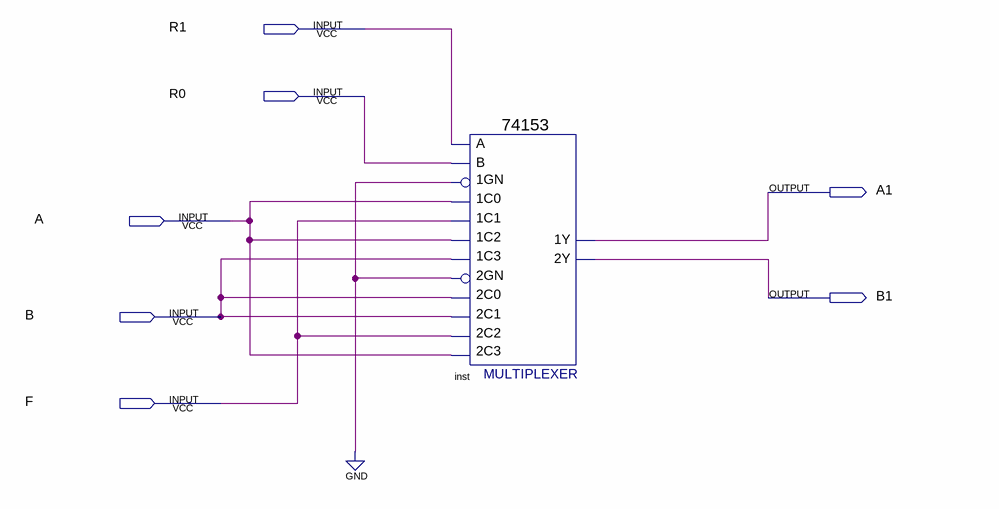
[diagram p0: schematic sheet]
// Quartus schematic ECElab3.bdf as structural Verilog: 1 symbols, 7 pins
module ECElab3 (
  input  R1,
  input  R0,
  input  A,
  input  B,
  input  F,
  output A1,
  output B1
);

  \74153  inst (
    .\1C1 (F), .\1GN (1'b0), .\1C0 (A), .\2C0 (B), .\2GN (1'b0), .\2C2 (F), .\1C2 (A), .\1C3 (B), .B(R0),
    .A(R1), .\2C1 (B), .\2C3 (A), .\1Y (A1), .\2Y (B1));
endmodule
